# Altium schematic sheet QR_Scanning_V1_STM32.SchDoc
size 381 x 241 mm; SheetNumber: 1; SheetTotal: 3
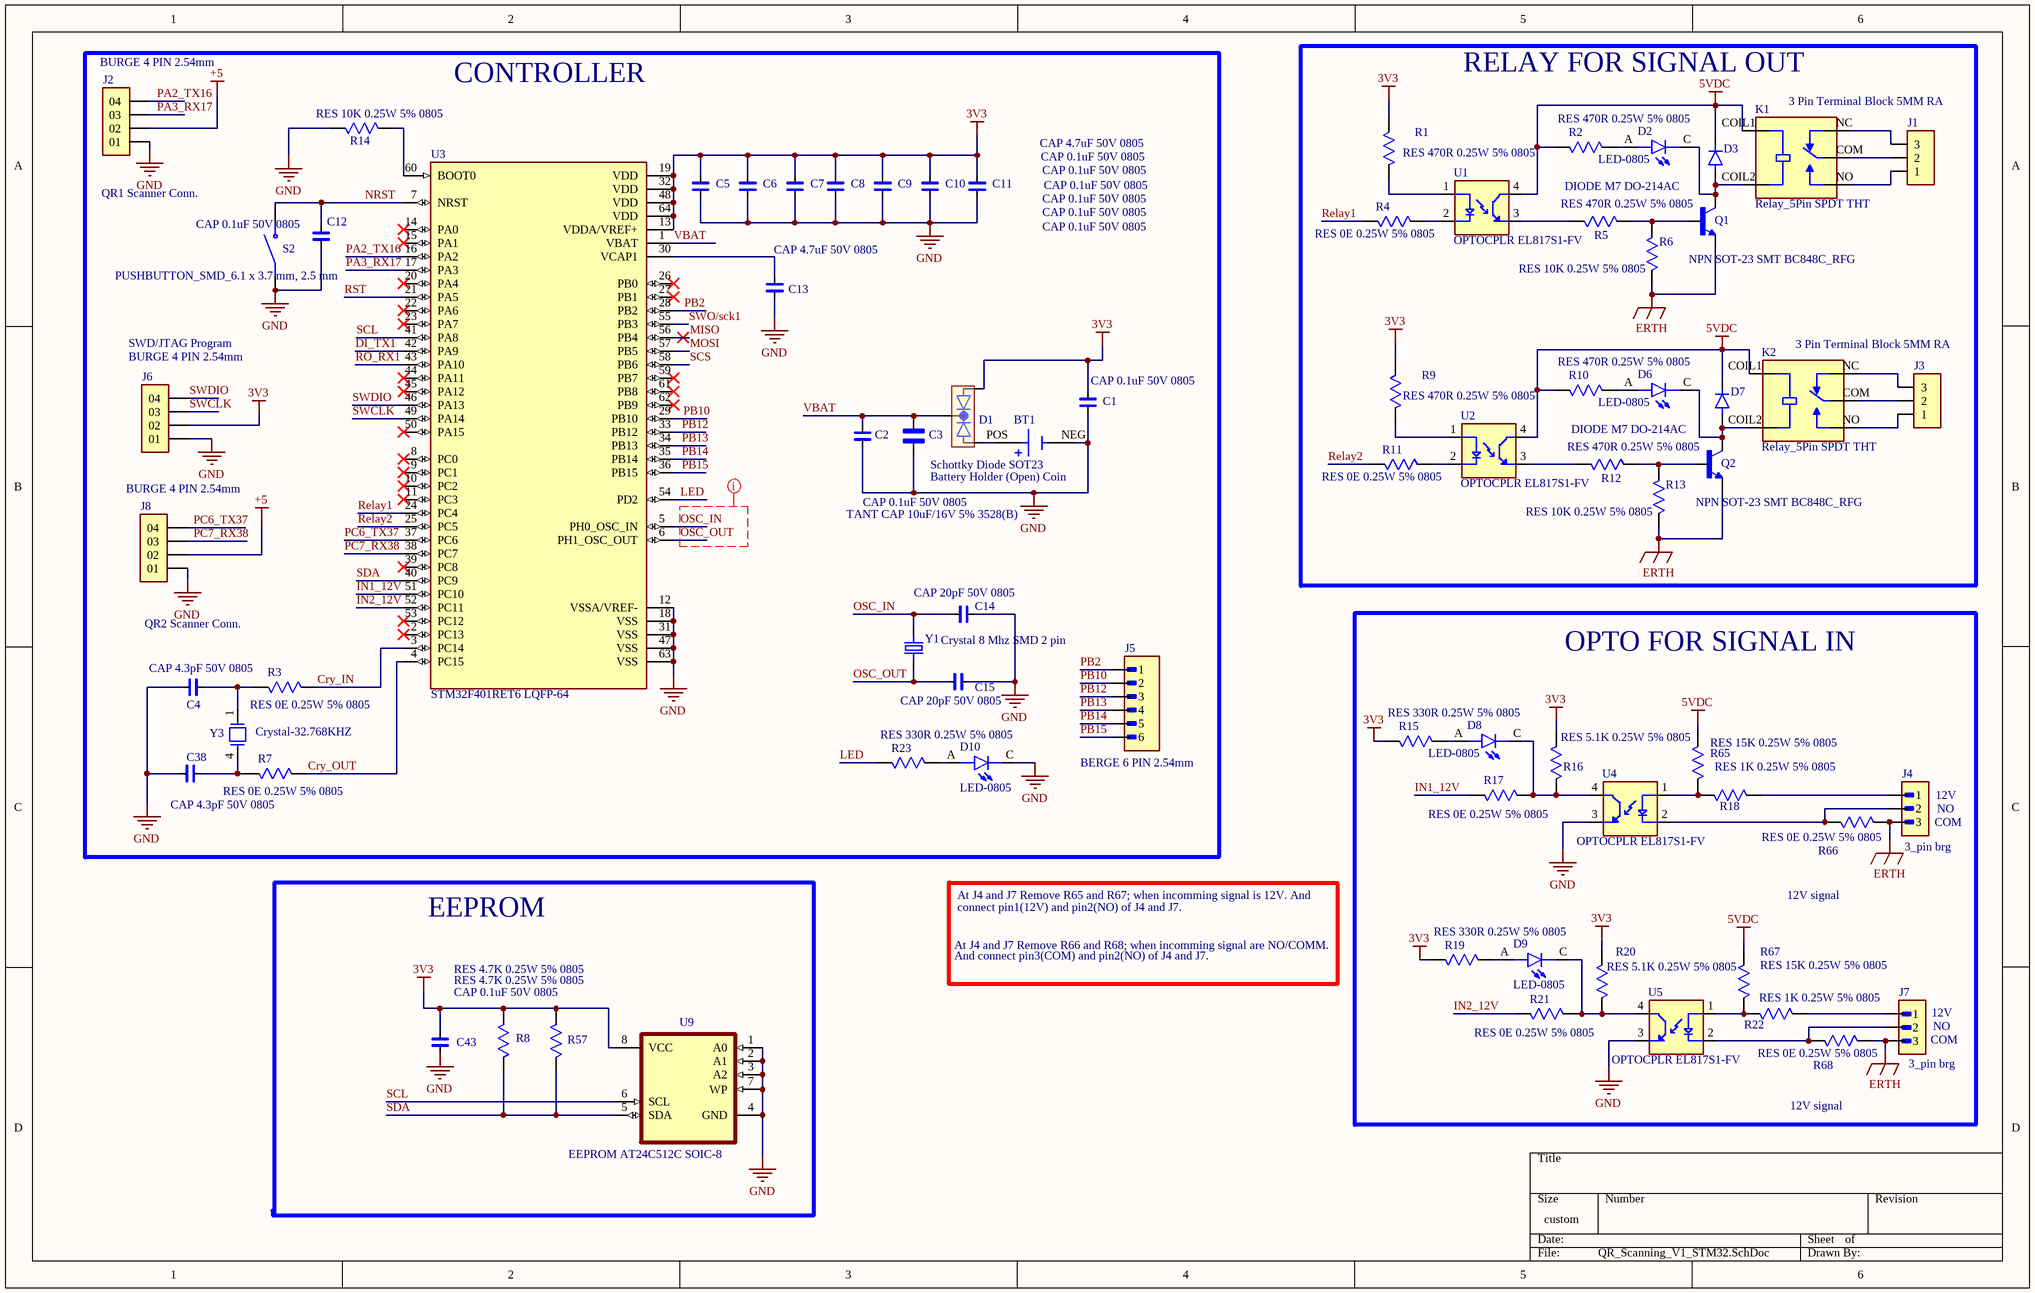
[diagram p0: QR_Scanning_V1_STM32.SchDoc]

## Parts
BT1  Battery Holder (Open) Coin  [Battery Holder (Open) Coin]
C1  CAP 0.1uF 50V 0805  [CAP CER 0.1uF/50V 5%]
C2  CAP 0.1uF 50V 0805  [CAP CER 0.1uF/50V 5%]
C3  TANT CAP 10uF/16V 5% 3528(B)  [TANT CAP 3528(B)]
C4  CAP 4.3pF 50V 0805  [CAP CER 0.1uF/50V 5%]
C5  CAP 0.1uF 50V 0805  [CAP CER 0.1uF/50V 5%]
C6  CAP 0.1uF 50V 0805  [CAP CER 0.1uF/50V 5%]
C7  CAP 0.1uF 50V 0805  [CAP CER 0.1uF/50V 5%]
C8  CAP 0.1uF 50V 0805  [CAP CER 0.1uF/50V 5%]
C9  CAP 0.1uF 50V 0805  [CAP CER 0.1uF/50V 5%]
C10  CAP 0.1uF 50V 0805  [CAP CER 0.1uF/50V 5%]
C11  CAP 4.7uF 50V 0805  [CAP CER 0.1uF/50V 5%]
C12  CAP 0.1uF 50V 0805  [CAP CER 0.1uF/50V 5%]
C13  CAP 4.7uF 50V 0805  [CAP CER 0.1uF/50V 5%]
C14  CAP 20pF 50V 0805  [CAP CER 0.1uF/50V 5%]
C15  CAP 20pF 50V 0805  [CAP CER 0.1uF/50V 5%]
C38  CAP 4.3pF 50V 0805  [CAP CER 0.1uF/50V 5%]
C43  CAP 0.1uF 50V 0805  [CAP CER 0.1uF/50V 5%]
D1  Schottky Diode SOT23  [Schottky Diode SOT23 BAT54C]
D2  LED-0805  [LED-0805]
D3  DIODE M7 DO-214AC  [DIODE M7 DO-214AC]
D6  LED-0805  [LED-0805]
D7  DIODE M7 DO-214AC  [DIODE M7 DO-214AC]
D8  LED-0805  [LED-0805]
D9  LED-0805  [LED-0805]
D10  LED-0805  [LED-0805]
J1  3 Pin Terminal Block 5MM RA  [3 Pin Terminal Block 5MM RA]
J2  BURGE 4 PIN 2.54mm  [BURGE 4 PIN 2.54mm]
J3  3 Pin Terminal Block 5MM RA  [3 Pin Terminal Block 5MM RA]
J4  3_pin brg  [3_pin brg]
J5  BERGE 6 PIN 2.54mm  [BERGE 6 PIN 2.54mm]
J6  BURGE 4 PIN 2.54mm  [BURGE 4 PIN 2.54mm]
J7  3_pin brg  [3_pin brg]
J8  BURGE 4 PIN 2.54mm  [BURGE 4 PIN 2.54mm]
K1  Relay_5Pin SPDT THT  [Relay_5Pin SPDT THT]
K2  Relay_5Pin SPDT THT  [Relay_5Pin SPDT THT]
Q1  NPN SOT-23 SMT BC848C_RFG  [NPN SOT-23 SMT BC848C_RFG]
Q2  NPN SOT-23 SMT BC848C_RFG  [NPN SOT-23 SMT BC848C_RFG]
R1  RES 470R 0.25W 5% 0805  [RES 0805 10K/0.25W 5%]
R2  RES 470R 0.25W 5% 0805  [RES 0805 10K/0.25W 5%]
R3  RES 0E 0.25W 5% 0805  [RES 0805 10K/0.25W 5%]
R4  RES 0E 0.25W 5% 0805  [RES 0805 10K/0.25W 5%]
R5  RES 470R 0.25W 5% 0805  [RES 0805 10K/0.25W 5%]
R6  RES 10K 0.25W 5% 0805  [RES 0805 10K/0.25W 5%]
R7  RES 0E 0.25W 5% 0805  [RES 0805 10K/0.25W 5%]
R8  RES 4.7K 0.25W 5% 0805  [RES 0805 10K/0.25W 5%]
R9  RES 470R 0.25W 5% 0805  [RES 0805 10K/0.25W 5%]
R10  RES 470R 0.25W 5% 0805  [RES 0805 10K/0.25W 5%]
R11  RES 0E 0.25W 5% 0805  [RES 0805 10K/0.25W 5%]
R12  RES 470R 0.25W 5% 0805  [RES 0805 10K/0.25W 5%]
R13  RES 10K 0.25W 5% 0805  [RES 0805 10K/0.25W 5%]
R14  RES 10K 0.25W 5% 0805  [RES 0805 10K/0.25W 5%]
R15  RES 330R 0.25W 5% 0805  [RES 0805 10K/0.25W 5%]
R16  RES 5.1K 0.25W 5% 0805  [RES 0805 10K/0.25W 5%]
R17  RES 0E 0.25W 5% 0805  [RES 0805 10K/0.25W 5%]
R18  RES 1K 0.25W 5% 0805  [RES 0805 10K/0.25W 5%]
R19  RES 330R 0.25W 5% 0805  [RES 0805 10K/0.25W 5%]
R20  RES 5.1K 0.25W 5% 0805  [RES 0805 10K/0.25W 5%]
R21  RES 0E 0.25W 5% 0805  [RES 0805 10K/0.25W 5%]
R22  RES 1K 0.25W 5% 0805  [RES 0805 10K/0.25W 5%]
R23  RES 330R 0.25W 5% 0805  [RES 0805 10K/0.25W 5%]
R57  RES 4.7K 0.25W 5% 0805  [RES 0805 10K/0.25W 5%]
R65  RES 15K 0.25W 5% 0805  [RES 0805 10K/0.25W 5%]
R66  RES 0E 0.25W 5% 0805  [RES 0805 10K/0.25W 5%]
R67  RES 15K 0.25W 5% 0805  [RES 0805 10K/0.25W 5%]
R68  RES 0E 0.25W 5% 0805  [RES 0805 10K/0.25W 5%]
S2  PUSHBUTTON_SMD_6.1 x 3.7 mm, 2.5 mm  [PUSHBUTTON_SMD_6.1 x 3.7 mm, 2.5 mm]
U1  OPTOCPLR EL817S1-FV  [OPTOCPLR EL817S1-FV]
U2  OPTOCPLR EL817S1-FV  [OPTOCPLR EL817S1-FV]
U3  STM32F401RET6 LQFP-64  [STM32F401RE Cortex-M4]
U4  OPTOCPLR EL817S1-FV  [OPTOCPLR EL817S1-FV]
U5  OPTOCPLR EL817S1-FV  [OPTOCPLR EL817S1-FV]
U9  EEPROM AT24C512C SOIC-8  [EEPROM AT24C512C SOIC-8]
Y1  Crystal 8 Mhz SMD 2 pin  [Crystal 16 Mhz SMD 2 pin]
Y3  Crystal-32.768KHZ  [Crystal-32.768KHZ]

## Blocks framed on the sheet
CONTROLLER: BT1 C1-C15 C38 D1 D10 J2 J5 J6 J8 R3 R7 R14 R23 S2 U3 Y1 Y3
RELAY FOR SIGNAL OUT: D2 D3 D6 D7 J1 J3 K1 K2 Q1 Q2 R1 R2 R4-R6 R9-R13 U1 U2
OPTO FOR SIGNAL IN: D8 D9 J4 J7 R15-R22 R65-R68 U4 U5

## Nets
3V3: C1.2 C5.2 C6.2 C7.2 C8.2 C9.2 C10.2 C11.2 C43.2 D1.1(A1) J6.02 R1.2 R8.2 R9.2 R15.2 R16.1 R19.2 R20.1 R57.2 U3.13(VDDA/VREF+) U3.19(VDD) U3.32(VDD) U3.48(VDD) U3.64(VDD) U9.8(VCC)
5VDC: D3.C(K) D7.C(K) K1.COIL1 K2.COIL1 R2.2 R10.2 R65.1 R67.1 U1.4(CT) U2.4(CT)
+5: J2.02 J8.02
ERTH: J4.3 J7.3 Q1.2(E) Q2.2(E) R6.1 R13.1 R66.1 R68.1
GND: BT1.NEG C1.1 C2.1 C3.2 C4.2 C5.1 C6.1 C7.1 C8.1 C9.1 C10.1 C11.1 C12.1 C13.1 C14.2 C15.2 C38.2 C43.1 D10.C J2.01 J6.01 J8.01 R14.1 S2.1 U3.12(VSSA/VREF-) U3.18(VSS) U3.31(VSS) U3.47(VSS) U3.63(VSS) U4.3(ET) U5.3(ET) U9.1(A0) U9.2(A1) U9.3(A2) U9.4(GND) U9.7(WP)
Cry_IN: R3.1 U3.3(PC14)
Cry_OUT: R7.1 U3.4(PC15)
DI_TX1: U3.42(PA9)
IN1_12V: R17.2 U3.51(PC10)
IN2_12V: R21.2 U3.52(PC11)
LED: R23.2 U3.54(PD2)
MISO: U3.56(PB4)
MOSI: U3.57(PB5)
NRST: C12.2 S2.2 U3.7(NRST)
OSC_IN: C14.1 U3.5(PH0_OSC_IN) Y1.2
OSC_OUT: C15.1 U3.6(PH1_OSC_OUT) Y1.1
PA2_TX16: J2.04 U3.16(PA2)
PA3_RX17: J2.03 U3.17(PA3)
PB2: J5.1 U3.28(PB2)
PB10: J5.2 U3.29(PB10)
PB12: J5.3 U3.33(PB12)
PB13: J5.4 U3.34(PB13)
PB14: J5.5 U3.35(PB14)
PB15: J5.6 U3.36(PB15)
PC6_TX37: J8.04 U3.37(PC6)
PC7_RX38: J8.03 U3.38(PC7)
Relay1: R4.2 U3.24(PC4)
Relay2: R11.2 U3.25(PC5)
RO_RX1: U3.43(PA10)
RST: U3.21(PA5)
SCL: U3.41(PA8) U9.6(SCL)
SCS: U3.58(PB6)
SDA: R8.1 R57.1 U3.40(PC9) U9.5(SDA)
SWCLK: J6.03 U3.49(PA14)
SWDIO: J6.04 U3.46(PA13)
SWO/sck1: U3.55(PB3)
VBAT: C2.2 C3.1 D1.3(C) U3.1(VBAT)
NetBT1_POS: BT1.POS D1.2(A2)
NetC4_1: C4.1 R3.2 Y3.1
NetC13_2: C13.2 U3.30(VCAP1)
NetC38_1: C38.1 R7.2 Y3.4
NetD2_A: D2.A R2.1
NetD2_C: D2.C D3.A K1.COIL2 Q1.3(C)
NetD6_A: D6.A R10.1
NetD6_C: D6.C D7.A K2.COIL2 Q2.3(C)
NetD8_A: D8.A R15.1
NetD8_C: D8.C R16.2 R17.1 U4.4(CT)
NetD9_A: D9.A R19.1
NetD9_C: D9.C R20.2 R21.1 U5.4(CT)
NetD10_A: D10.A R23.1
NetJ1_1: J1.1 K1.NO
NetJ1_2: J1.2 K1.COM
NetJ1_3: J1.3 K1.NC
NetJ3_1: J3.1 K2.NO
NetJ3_2: J3.2 K2.COM
NetJ3_3: J3.3 K2.NC
NetJ4_1: J4.1 R18.1
NetJ4_2: J4.2 R66.2 U4.2(C)
NetJ7_1: J7.1 R22.1
NetJ7_2: J7.2 R68.2 U5.2(C)
NetQ1_1: Q1.1(B) R5.2 R6.2
NetQ2_1: Q2.1(B) R12.2 R13.2
NetR1_1: R1.1 U1.1(A)
NetR4_1: R4.1 U1.2(C)
NetR5_1: R5.1 U1.3(ET)
NetR9_1: R9.1 U2.1(A)
NetR11_1: R11.1 U2.2(C)
NetR12_1: R12.1 U2.3(ET)
NetR14_2: R14.2 U3.60(BOOT0)
NetR18_2: R18.2 R65.2 U4.1(A)
NetR22_2: R22.2 R67.2 U5.1(A)

Not connected (* = marked no-connect by the designer): U3 2(PC13)* 8(PC0)* 9(PC1)* 10(PC2)* 11(PC3)* 14(PA0)* 15(PA1)* 20(PA4)* 22(PA6)* 23(PA7)* 26(PB0)* 27(PB1)* 39(PC8)* 44(PA11)* 45(PA12)* 50(PA15)* 53(PC12)* 59(PB7)* 61(PB8)* 62(PB9)*

## Layout directives
net class Single_50 ohm: OSC_IN, OSC_OUT

## Notes on the sheet
- (near J2) QR1 Scanner Conn.
- (near J6) SWD/JTAG Program
- QR2 Scanner Conn.
- (near J4) COM
- (near J4) 12V
- (near J4) NO
- At J4 and J7 Remove R65 and R67; when incomming signal is 12V. And
- connect pin1(12V) and pin2(NO) of J4 and J7.
- 12V signal
- EEPROM
- At J4 and J7 Remove R66 and R68; when incomming signal are NO/COMM.
- And connect pin3(COM) and pin2(NO) of J4 and J7.
- (near J7) COM
- (near J7) 12V
- (near J7) NO
- (in symbol TANT CAP 10uF/16V 5% 3528(B)) +

## Library data of the parts
BT1 = Battery Holder (Open) Coin: Battery Holder (Open) Coin, 20.0mm 1 Cell SMD (SMT) Tab, CR2032, BS-7-RED; Package: None; Price: None; Value: *; MP: BS-7-RED; Availability: Unavailable
C1 C2 C4-C15 C38 C43 = CAP CER 0.1uF/50V 5%: CAP CER 0.1uF/50V  Ceramic Capacitor X7R 0805 (2012 Metric) SMT; MF: Samsung; MP: CL21B104KCFNNNE; Purchase-URL: https://pricing.snapeda.com/search?q=CL21B104KCFNNNE&ref=eda; Package: 0805 Samsung; Check_prices: https://www.snapeda.com/parts/CL21B104KCFNNNE/Samsung+Electro-Mechanics/view-part/?ref=eda; Value: *; SnapEDA_Link: https://www.snapeda.com/parts/CL21B104KCFNNNE/Samsung+Electro-Mechanics/view-part/?ref=snap; Digi-Key_Part_Number: 1276-6840-2-ND
C3 = TANT CAP 10uF/16V 5% 3528(B): 10 ÂµF Molded Tantalum Polymer Capacitor 25 V 1411 (3528 Metric), 1210 150mOhm TCJB106M025R0150; MF: AVX; SnapEDA_Link: https://www.snapeda.com/parts/TCJB106M025R0150/AVX/view-part/?ref=snap; Package: 1210 AVX; Value: *; MP: TCJB106M025R0150; Check_prices: https://www.snapeda.com/parts/TCJB106M025R0150/AVX/view-part/?ref=eda
D1 = Schottky Diode SOT23 BAT54C: Schottky Diode 2x ComCath 0.2A 30V SOT23 | Diodes Inc BAT54C; MF: Diodes Inc.; MP: BAT54C-7-F; SnapEDA_Link: https://www.snapeda.com/parts/BAT54C-7-F/Diodes+Inc./view-part/?ref=snap; Package: SOT-23 Diodes Inc.; Value: *; Check_prices: https://www.snapeda.com/parts/BAT54C-7-F/Diodes+Inc./view-part/?ref=eda
D2 D6 D8-D10 = LED-0805: Red 640nm LED Indication - Discrete 1.85V 0805 (2012 Metric) APT2012SRCPRV; MF: Kingbright; SnapEDA_Link: https://www.snapeda.com/parts/APT2012SRCPRV/Kingbright/view-part/?ref=snap; Package: 0805 Kingbright; Value: *; MP: APT2012SRCPRV; Check_prices: https://www.snapeda.com/parts/APT2012SRCPRV/Kingbright/view-part/?ref=eda
D3 D7 = DIODE M7 DO-214AC: M7 General Purpose SMD Rectifier Diode SMA (DO-214AC) 1A 1000V 1n4007 RS2MA; MF: Taiwan Semiconductor; SnapEDA_Link: https://www.snapeda.com/parts/RS2MA/Taiwan+Semiconductor/view-part/?ref=snap; Package: DO-214AC-2 Taiwan Semiconductor; Value: *; MP: RS2MA; Check_prices: https://www.snapeda.com/parts/RS2MA/Taiwan+Semiconductor/view-part/?ref=eda
J1 J3 = 3 Pin Terminal Block 5MM RA: 3 Pin Terminal Block HDR 5MM THT RA 231-433_001-000; MP: 231-433/001-000; MF: WAGO; SnapEDA_Link: https://www.snapeda.com/parts/231-433/001-000/WAGO/view-part/482062/?ref=snap; Package: None; Availability: Unavailable; Price: None; Value: *
J2 J6 J8 = BURGE 4 PIN 2.54mm: Conn Unshrouded Header HDR 4 POS 2.54mm Solder ST Top Entry Thru-Hole Bulk TSW-104-17-G-S-LL; MF: Samtec; MP: TSW-104-23-H-S-LL; SnapEDA_Link: https://www.snapeda.com/parts/TSW-104-23-H-S-LL/Samtec/view-part/?ref=snap; Package: None; Value: *; Check_prices: https://www.snapeda.com/parts/TSW-104-23-H-S-LL/Samtec/view-part/?ref=eda
J4 J7 = 3_pin brg: 3_pin burge 2.54mm; MP: 68001-403HLF; Package: None; Price: None; Value: *; Availability: Unavailable
J5 = BERGE 6 PIN 2.54mm: BergStik, Board to Board connector, Unshrouded Vertical Header, Through Hole, Single Row, 6 Positions, 2.54 mm (0.100in) Pitch. 68604-406HLF; MF: AMPHENOL ICC / FCI; SnapEDA_Link: https://www.snapeda.com/parts/68604-406HLF/Amphenol/view-part/?ref=snap; Package: None; Value: *; MP: 68604-406HLF; Check_prices: https://www.snapeda.com/parts/68604-406HLF/Amphenol/view-part/?ref=eda
K1 K2 = Relay_5Pin SPDT THT: Relays General Purpose Non Latching 3VDC SPDT 10A (250VAC) Max 5PIN SRD-03VDC-SL-C; MF: Songle Relay; SnapEDA_Link: https://www.snapeda.com/parts/SRD-03VDC-SL-C/Songle+Relay/view-part/?ref=snap; Package: NON STANDARD-5 Songle Relay; Value: *; MP: SRD-03VDC-SL-C; Check_prices: https://www.snapeda.com/parts/SRD-03VDC-SL-C/Songle+Relay/view-part/?ref=eda
Q1 Q2 = NPN SOT-23 SMT BC848C_RFG: NPN SMT BC848C_RFG SOT-23, 30V, 0.1A, NPN Transistor; MF: Taiwan Semiconductor; MP: BC848C RFG; SnapEDA_Link: https://www.snapeda.com/parts/BC848C%20RFG/Taiwan+Semiconductor/view-part/?ref=snap; Package: SOT-23 Taiwan Semiconductor; Value: *; Check_prices: https://www.snapeda.com/parts/BC848C%20RFG/Taiwan+Semiconductor/view-part/?ref=eda
R1-R23 R57 R65-R68 = RES 10K 0.25W 5% 0805: RESISTOR, THICK FILM, 10K, 5%, 0805 0.25W SMT; MP: ERJ-6GEYJ103V; MF: Panasonic Electronic; Price: None; Check_prices: https://www.snapeda.com/parts/ERJ-6GEYJ103V/Panasonic+Electronic+Components/view-part/?ref=eda; Package: 805-2 Panasonic; Purchase-URL: https://pricing.snapeda.com/search/part/ERJ-6GEYJ103V/?ref=eda; Availability: In Stock; SnapEDA_Link: https://www.snapeda.com/parts/ERJ-6GEYJ103V/Panasonic+Electronic+Components/view-part/?ref=snap; Value: *
S2 = PUSHBUTTON_SMD_6.1 x 3.7 mm, 2.5 mm: 6.1 x 3.7 mm, 2.5 mm Actuator Height, 260 gf, Red, Surface Mount, SPST, Tactile Switch, TS09-63-25-R-260-SMT-TR; MF: Same Sky; SnapEDA_Link: https://www.snapeda.com/parts/TS09-63-25-R-260-SMT-TR/Same+Sky/view-part/?ref=snap; Package: None; Value: *; MP: TS09-63-25-R-260-SMT-TR; Check_prices: https://www.snapeda.com/parts/TS09-63-25-R-260-SMT-TR/Same+Sky/view-part/?ref=eda
U1 U2 U4 U5 = Optclr EL817S1-FV: Optoisoltr 5kv Transistor 4-Smd EL817S1-FV; MF: {'manufacturer': u'Everlight Electronics Co Ltd'}; MP: EL817S1(A)(TU)-V; Package: None; Price: None; Value: *; Availability: Unavailable
U3 = STM32F401RET6: ARMÂ® CortexÂ®-M4 STM32F4 Microcontroller IC 32-Bit Single-Core 84MHz 512KB (512K x 8) FLASH 64-LQFP (10x10); MF: STMicroelectronics; SnapEDA_Link: https://www.snapeda.com/parts/STM32F401RET6/STMicroelectronics/view-part/?ref=snap; Package: LQFP-64 STMicroelectronics; Value: *; MP: STM32F401RET6; Check_prices: https://www.snapeda.com/parts/STM32F401RET6/STMicroelectronics/view-part/?ref=eda
U9 = EEPROM AT24C512C SOIC-8: EEPROM Memory IC 512Kb (64K x 8) IÂ²C 400 kHz 900 ns SOIC-8 AT24C512C-SSHM-T; MF: Microchip; SnapEDA_Link: https://www.snapeda.com/parts/AT24C512C-SSHM-T/Microchip/view-part/?ref=snap; Package: SO-8 Microchip; Value: *; MP: AT24C512C-SSHM-T; Check_prices: https://www.snapeda.com/parts/AT24C512C-SSHM-T/Microchip/view-part/?ref=eda
Y1 = Crystal 16 Mhz SMD 2 pin_1: 16 MHz Â±30ppm Crystal 20pF 60 Ohms HC-49/US FOXSDLF/128-20 16 Mhz Crystal SMD –CSM-4ALX(28ALX) 12.5mmX4.85mmX4mm; MF: Fox Electronics; SnapEDA_Link: https://www.snapeda.com/parts/FOXSDLF/128-20/Fox+Electronics/view-part/?ref=snap; Package: HC49SD Fox Electronics; Value: *; MP: FOXSDLF/128-20; Check_prices: https://www.snapeda.com/parts/FOXSDLF/128-20/Fox+Electronics/view-part/?ref=eda
Y3 = Crystal-32.768KHZ: 32.768 kHz Â±20ppm Crystal 6pF 50 kOhms 4-SOJ, 5.50mm pitch ABS25-32.768KHZ-6-T; MF: Abracon; SnapEDA_Link: https://www.snapeda.com/parts/ABS25-32.768KHZ-6-T/Abracon/view-part/?ref=snap; Package: 4-4 Abracon; Value: *; MP: ABS25-32.768KHZ-6-T; Check_prices: https://www.snapeda.com/parts/ABS25-32.768KHZ-6-T/Abracon/view-part/?ref=eda